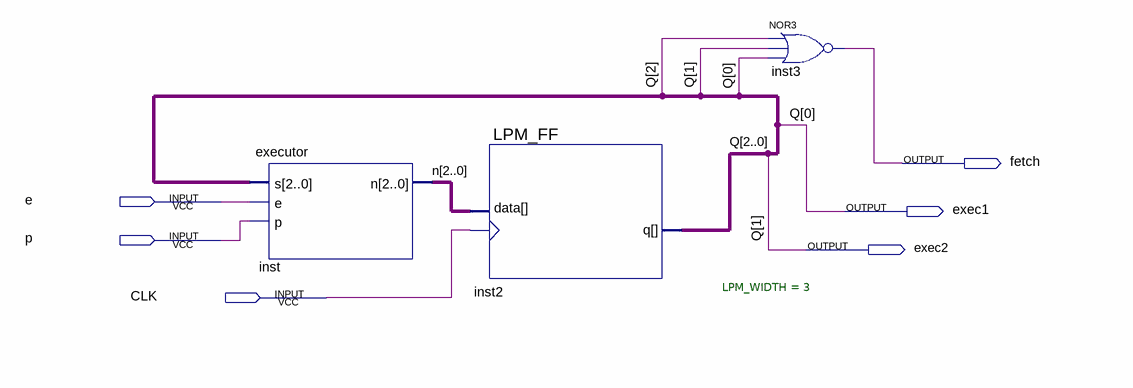
[diagram p0: schematic sheet]
// Quartus schematic StateMachine.bdf as structural Verilog: 3 symbols, 6 pins
module StateMachine (
  input  e,
  input  p,
  input  CLK,
  output fetch,
  output exec1,
  output exec2
);

  wire [2:0] n;
  wire [2:2] Q;

  executor inst (.s({Q[2], exec2, exec1}), .e(e), .p(p), .n(n));
  LPM_FF #(.LPM_WIDTH(3)) inst2 (.clock(CLK), .data(n), .q({Q[2], exec2, exec1}));
  nor inst3 (fetch, Q[2], exec2, exec1);

  // Other names for the same wires on the sheet: Q[1:0] = {exec2, exec1}
endmodule
